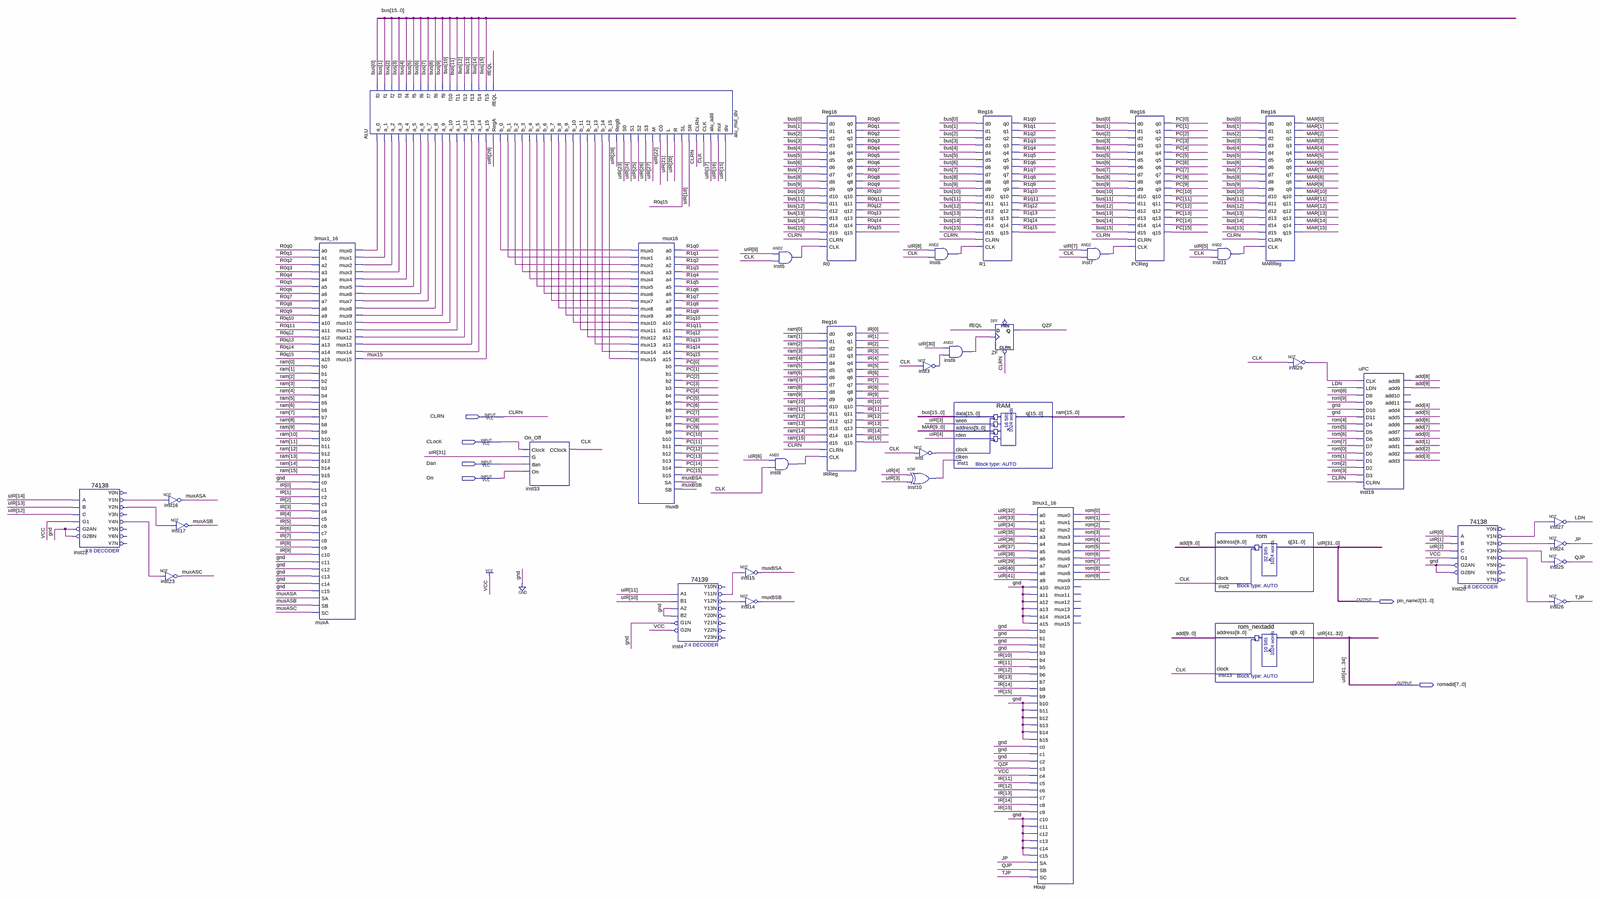
[diagram p0: schematic sheet, whole]
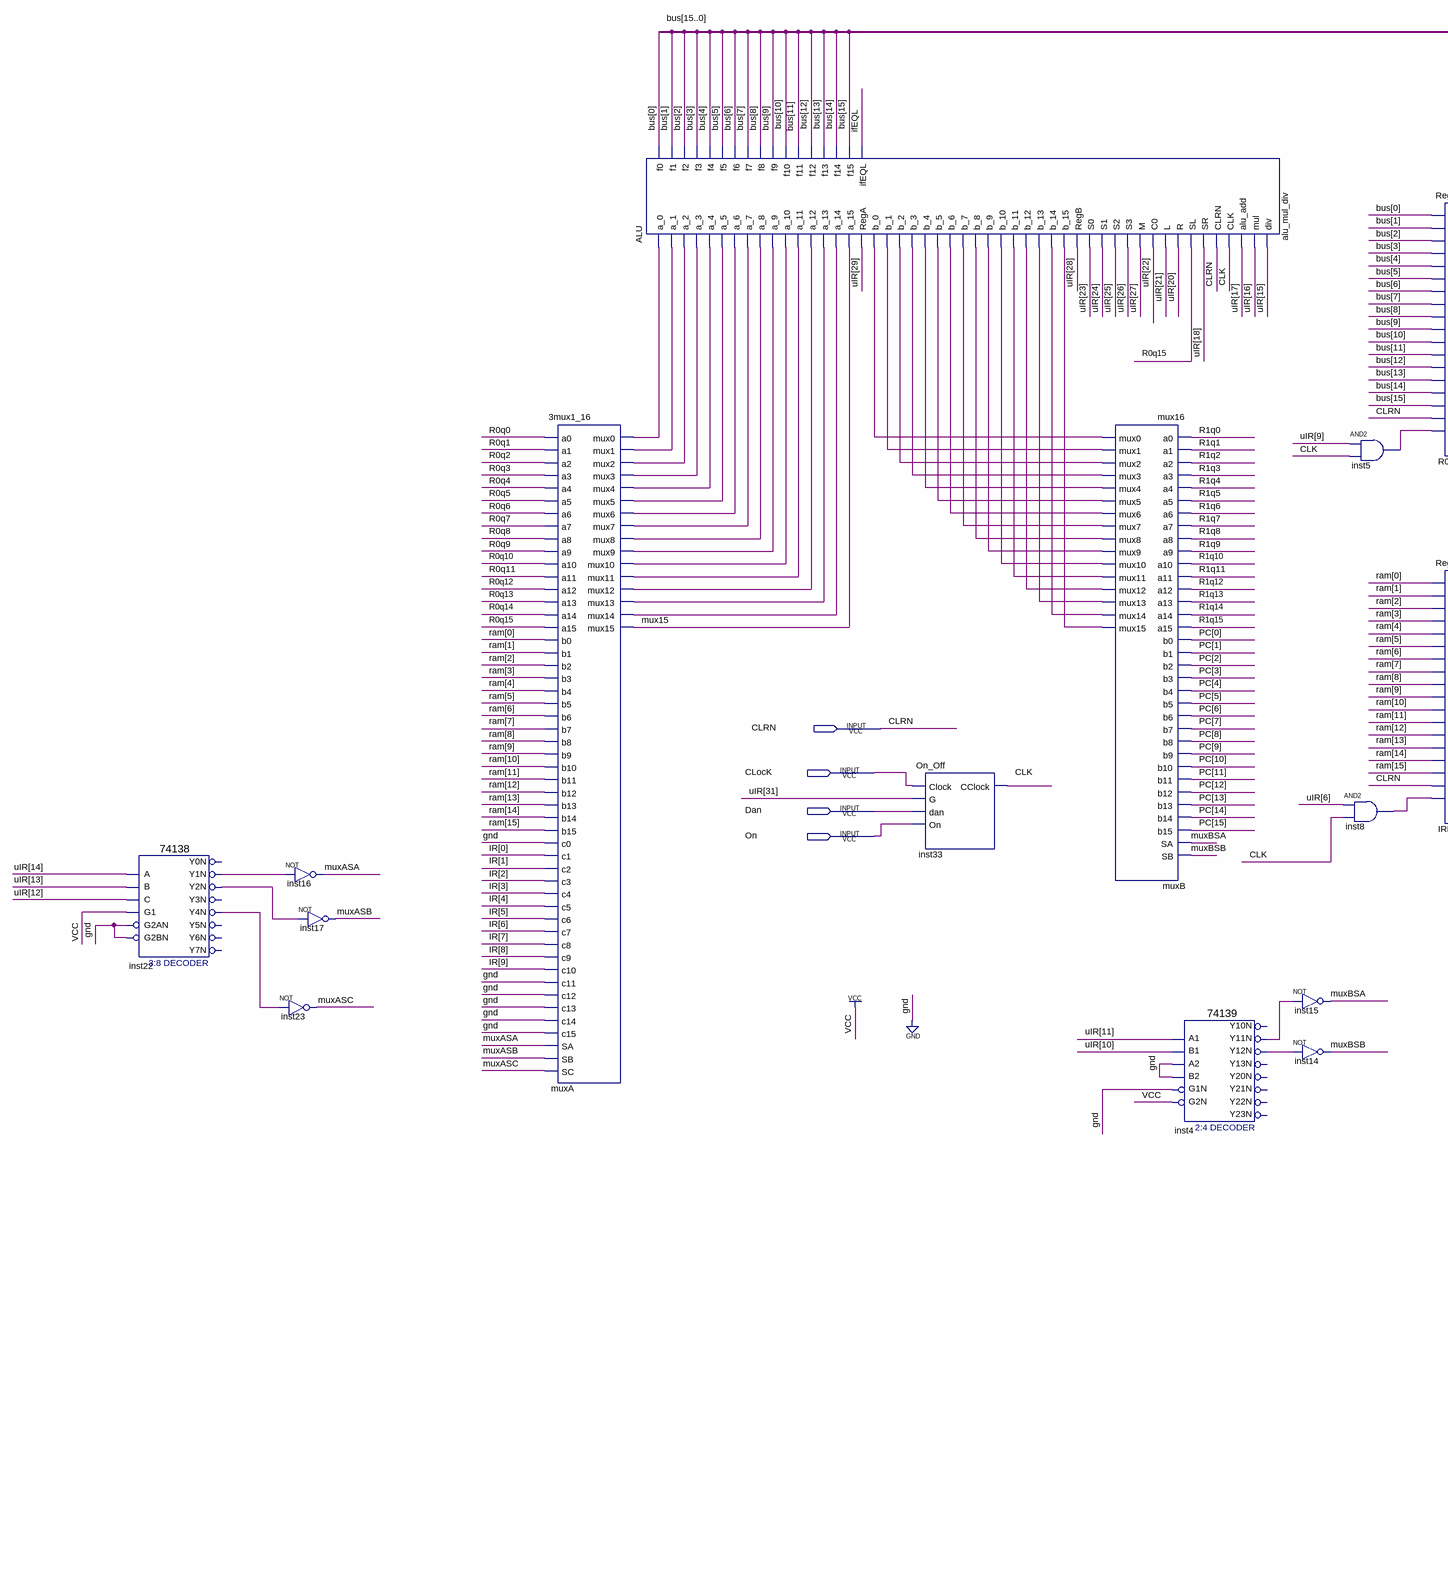
[diagram p1: schematic sheet, left part]
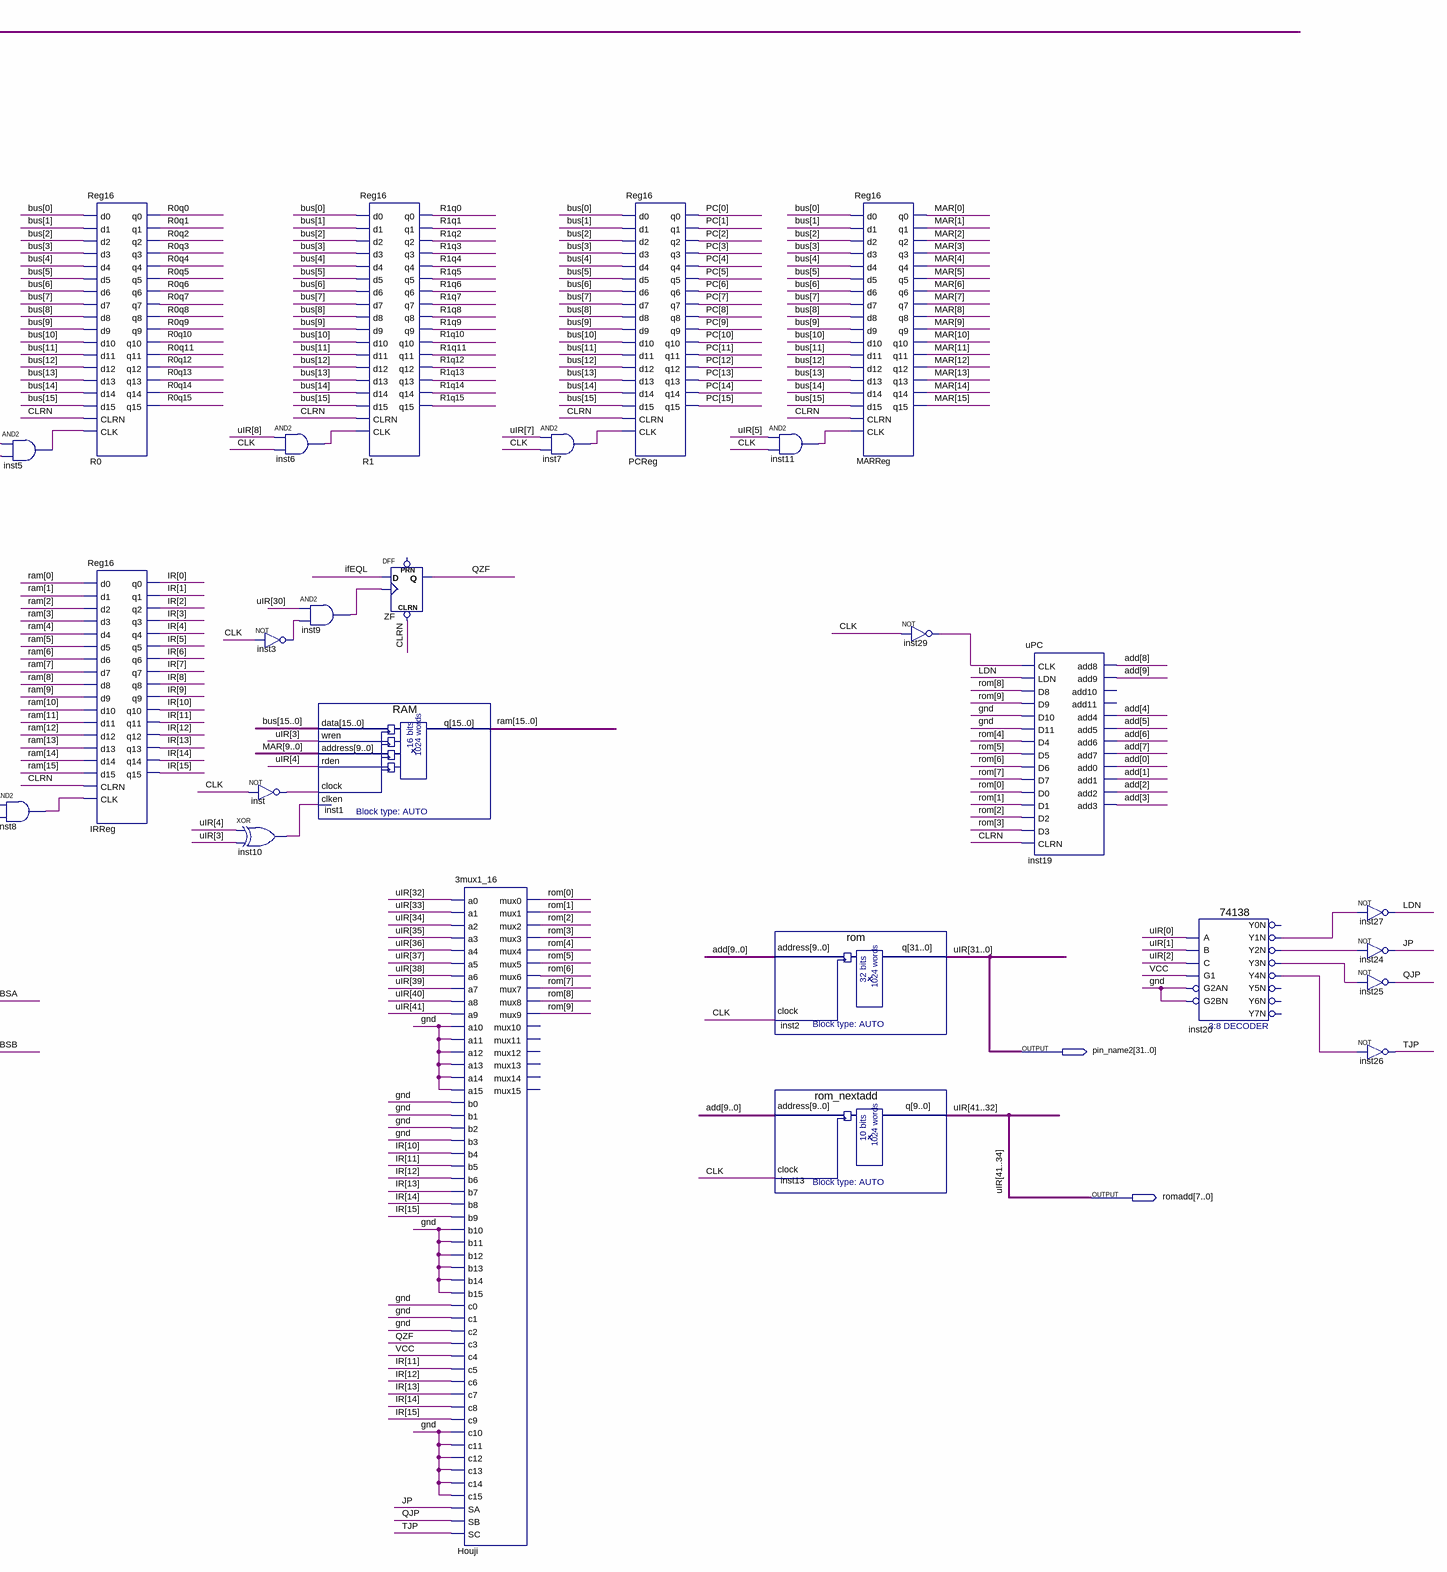
[diagram p2: schematic sheet, right part]
// Quartus schematic Micro_Programming.bdf as structural Verilog: 37 symbols, 6 pins
module Micro_Programming (
  input  CLRN,
  input  CLocK,
  input  Dan,
  input  On,
  output [31:0] pin_name2,
  output [7:0] romadd
);

  wire CLK, ifEQL, inst3_out, inst4_y11n, inst4_y12n, inst5_out, inst6_out, inst7_out, inst8_out, inst9_out,
       inst10_out, inst11_out, inst20_y1n, inst20_y2n, inst20_y3n, inst20_y4n, inst22_y1n, inst22_y2n,
       inst22_y4n, inst29_out, inst_out, JP, LDN, mux15, muxA_mux0, muxA_mux1, muxA_mux2, muxA_mux3,
       muxA_mux4, muxA_mux5, muxA_mux6, muxA_mux7, muxA_mux8, muxA_mux9, muxA_mux10, muxA_mux11, muxA_mux12,
       muxA_mux13, muxA_mux14, muxASA, muxASB, muxASC, muxB_mux0, muxB_mux1, muxB_mux2, muxB_mux3, muxB_mux4,
       muxB_mux5, muxB_mux6, muxB_mux7, muxB_mux8, muxB_mux9, muxB_mux10, muxB_mux11, muxB_mux12, muxB_mux13,
       muxB_mux14, muxB_mux15, muxBSA, muxBSB, QJP, QZF, R0q0, R0q1, R0q2, R0q3, R0q4, R0q5, R0q6, R0q7,
       R0q8, R0q9, R0q10, R0q11, R0q12, R0q13, R0q14, R0q15, R1q0, R1q1, R1q2, R1q3, R1q4, R1q5, R1q6, R1q7,
       R1q8, R1q9, R1q10, R1q11, R1q12, R1q13, R1q14, R1q15, TJP;
  wire [9:0] add, rom;
  wire [15:0] bus, IR, MAR, PC, ram;
  wire [33:32] uIR;

  \74138  inst22 (
    .A(pin_name2[14]), .B(pin_name2[13]), .G1(1'b1), .C(pin_name2[12]), .G2AN(1'b0), .G2BN(1'b0),
    .Y1N(inst22_y1n), .Y2N(inst22_y2n), .Y4N(inst22_y4n));  // open: Y0N, Y3N, Y5N, Y6N, Y7N
  not inst16 (muxASA, inst22_y1n);
  not inst17 (muxASB, inst22_y2n);
  not inst23 (muxASC, inst22_y4n);
  \3mux1_16  muxA (
    .a0(R0q0), .a1(R0q1), .a2(R0q2), .a3(R0q3), .a4(R0q4), .a5(R0q5), .a6(R0q6), .a7(R0q7), .a8(R0q8),
    .a9(R0q9), .a10(R0q10), .a11(R0q11), .a12(R0q12), .a13(R0q13), .a14(R0q14), .a15(R0q15), .b0(ram[0]),
    .b1(ram[1]), .b2(ram[2]), .b3(ram[3]), .b4(ram[4]), .b5(ram[5]), .b6(ram[6]), .b7(ram[7]), .b8(ram[8]),
    .b9(ram[9]), .b10(ram[10]), .b11(ram[11]), .b12(ram[12]), .b13(ram[13]), .b14(ram[14]), .b15(ram[15]),
    .c0(1'b0), .c1(IR[0]), .c2(IR[1]), .c3(IR[2]), .c4(IR[3]), .c5(IR[4]), .c6(IR[5]), .c7(IR[6]),
    .c8(IR[7]), .c9(IR[8]), .c10(IR[9]), .c11(1'b0), .c12(1'b0), .c13(1'b0), .c14(1'b0), .c15(1'b0),
    .SA(muxASA), .SB(muxASB), .SC(muxASC), .mux0(muxA_mux0), .mux1(muxA_mux1), .mux2(muxA_mux2),
    .mux3(muxA_mux3), .mux4(muxA_mux4), .mux5(muxA_mux5), .mux6(muxA_mux6), .mux7(muxA_mux7),
    .mux8(muxA_mux8), .mux9(muxA_mux9), .mux10(muxA_mux10), .mux11(muxA_mux11), .mux12(muxA_mux12),
    .mux13(muxA_mux13), .mux14(muxA_mux14), .mux15(mux15));
  ALU alu_mul_div (
    .a_0(muxA_mux0), .a_1(muxA_mux1), .a_2(muxA_mux2), .a_3(muxA_mux3), .a_4(muxA_mux4), .a_5(muxA_mux5),
    .a_6(muxA_mux6), .a_7(muxA_mux7), .a_8(muxA_mux8), .a_9(muxA_mux9), .a_10(muxA_mux10), .a_11(muxA_mux11),
    .a_12(muxA_mux12), .a_13(muxA_mux13), .a_14(muxA_mux14), .a_15(mux15), .RegA(pin_name2[29]),
    .b_0(muxB_mux0), .b_1(muxB_mux1), .b_2(muxB_mux2), .b_3(muxB_mux3), .b_4(muxB_mux4), .b_5(muxB_mux5),
    .b_6(muxB_mux6), .b_7(muxB_mux7), .b_8(muxB_mux8), .b_9(muxB_mux9), .b_10(muxB_mux10), .b_11(muxB_mux11),
    .b_12(muxB_mux12), .b_13(muxB_mux13), .b_14(muxB_mux14), .b_15(muxB_mux15), .RegB(pin_name2[28]),
    .S0(pin_name2[23]), .S1(pin_name2[24]), .S2(pin_name2[25]), .S3(pin_name2[26]), .M(pin_name2[27]),
    .C0(pin_name2[22]), .L(pin_name2[21]), .R(pin_name2[20]), .SL(R0q15), .SR(pin_name2[18]), .CLRN(CLRN),
    .CLK(CLK), .alu_add(pin_name2[17]), .mul(pin_name2[16]), .div(pin_name2[15]), .f0(bus[0]), .f1(bus[1]),
    .f2(bus[2]), .f3(bus[3]), .f4(bus[4]), .f5(bus[5]), .f6(bus[6]), .f7(bus[7]), .f8(bus[8]), .f9(bus[9]),
    .f10(bus[10]), .f11(bus[11]), .f12(bus[12]), .f13(bus[13]), .f14(bus[14]), .f15(bus[15]), .ifEQL(ifEQL));
  On_Off inst33 (.Clock(CLocK), .G(pin_name2[31]), .dan(Dan), .On(On), .CClock(CLK));
  mux16 muxB (
    .a0(R1q0), .a1(R1q1), .a2(R1q2), .a3(R1q3), .a4(R1q4), .a5(R1q5), .a6(R1q6), .a7(R1q7), .a8(R1q8),
    .a9(R1q9), .a10(R1q10), .a11(R1q11), .a12(R1q12), .a13(R1q13), .a14(R1q14), .a15(R1q15), .b0(PC[0]),
    .b1(PC[1]), .b2(PC[2]), .b3(PC[3]), .b4(PC[4]), .b5(PC[5]), .b6(PC[6]), .b7(PC[7]), .b8(PC[8]),
    .b9(PC[9]), .b10(PC[10]), .b11(PC[11]), .b12(PC[12]), .b13(PC[13]), .b14(PC[14]), .b15(PC[15]),
    .SA(muxBSA), .SB(muxBSB), .mux0(muxB_mux0), .mux1(muxB_mux1), .mux2(muxB_mux2), .mux3(muxB_mux3),
    .mux4(muxB_mux4), .mux5(muxB_mux5), .mux6(muxB_mux6), .mux7(muxB_mux7), .mux8(muxB_mux8),
    .mux9(muxB_mux9), .mux10(muxB_mux10), .mux11(muxB_mux11), .mux12(muxB_mux12), .mux13(muxB_mux13),
    .mux14(muxB_mux14), .mux15(muxB_mux15));
  \74139  inst4 (
    .A1(pin_name2[11]), .A2(1'b0), .B1(pin_name2[10]), .B2(1'b0), .G1N(1'b0), .G2N(1'b1), .Y12N(inst4_y12n),
    .Y11N(inst4_y11n));  // open: Y10N, Y20N, Y13N, Y21N, Y22N, Y23N
  not inst15 (muxBSA, inst4_y11n);
  not inst14 (muxBSB, inst4_y12n);
  and inst5 (inst5_out, pin_name2[9], CLK);
  and inst8 (inst8_out, pin_name2[6], CLK);
  Reg16 R0 (
    .d0(bus[0]), .d1(bus[1]), .d2(bus[2]), .d3(bus[3]), .d4(bus[4]), .d5(bus[5]), .d6(bus[6]), .d7(bus[7]),
    .d8(bus[8]), .d9(bus[9]), .d10(bus[10]), .d11(bus[11]), .d12(bus[12]), .d13(bus[13]), .d14(bus[14]),
    .d15(bus[15]), .CLRN(CLRN), .CLK(inst5_out), .q0(R0q0), .q1(R0q1), .q2(R0q2), .q3(R0q3), .q4(R0q4),
    .q5(R0q5), .q6(R0q6), .q7(R0q7), .q8(R0q8), .q9(R0q9), .q10(R0q10), .q11(R0q11), .q12(R0q12),
    .q13(R0q13), .q14(R0q14), .q15(R0q15));
  Reg16 IRReg (
    .d0(ram[0]), .d1(ram[1]), .d2(ram[2]), .d3(ram[3]), .d4(ram[4]), .d5(ram[5]), .d6(ram[6]), .d7(ram[7]),
    .d8(ram[8]), .d9(ram[9]), .d10(ram[10]), .d11(ram[11]), .d12(ram[12]), .d13(ram[13]), .d14(ram[14]),
    .d15(ram[15]), .CLRN(CLRN), .CLK(inst8_out), .q0(IR[0]), .q1(IR[1]), .q2(IR[2]), .q3(IR[3]), .q4(IR[4]),
    .q5(IR[5]), .q6(IR[6]), .q7(IR[7]), .q8(IR[8]), .q9(IR[9]), .q10(IR[10]), .q11(IR[11]), .q12(IR[12]),
    .q13(IR[13]), .q14(IR[14]), .q15(IR[15]));
  xor inst10 (inst10_out, pin_name2[4], pin_name2[3]);
  and inst6 (inst6_out, pin_name2[8], CLK);
  not inst3 (inst3_out, CLK);
  not inst (inst_out, CLK);
  and inst9 (inst9_out, pin_name2[30], inst3_out);
  RAM inst1 (
    .data(bus), .wren(pin_name2[3]), .address(MAR[9:0]), .rden(pin_name2[4]), .clock(inst_out),
    .clken(inst10_out), .q(ram));
  Reg16 R1 (
    .d0(bus[0]), .d1(bus[1]), .d2(bus[2]), .d3(bus[3]), .d4(bus[4]), .d5(bus[5]), .d6(bus[6]), .d7(bus[7]),
    .d8(bus[8]), .d9(bus[9]), .d10(bus[10]), .d11(bus[11]), .d12(bus[12]), .d13(bus[13]), .d14(bus[14]),
    .d15(bus[15]), .CLRN(CLRN), .CLK(inst6_out), .q0(R1q0), .q1(R1q1), .q2(R1q2), .q3(R1q3), .q4(R1q4),
    .q5(R1q5), .q6(R1q6), .q7(R1q7), .q8(R1q8), .q9(R1q9), .q10(R1q10), .q11(R1q11), .q12(R1q12),
    .q13(R1q13), .q14(R1q14), .q15(R1q15));
  DFF ZF (.CLRN(CLRN), .CLK(inst9_out), .D(ifEQL), .Q(QZF));  // open: PRN
  \3mux1_16  Houji (
    .a0(uIR[32]), .a1(uIR[33]), .a2(romadd[0]), .a3(romadd[1]), .a4(romadd[2]), .a5(romadd[3]),
    .a6(romadd[4]), .a7(romadd[5]), .a8(romadd[6]), .a9(romadd[7]), .a10(1'b0), .a11(1'b0), .a12(1'b0),
    .a13(1'b0), .a14(1'b0), .a15(1'b0), .b0(1'b0), .b1(1'b0), .b2(1'b0), .b3(1'b0), .b4(IR[10]), .b5(IR[11]),
    .b6(IR[12]), .b7(IR[13]), .b8(IR[14]), .b9(IR[15]), .b10(1'b0), .b11(1'b0), .b12(1'b0), .b13(1'b0),
    .b14(1'b0), .b15(1'b0), .c0(1'b0), .c1(1'b0), .c2(1'b0), .c3(QZF), .c4(1'b1), .c5(IR[11]), .c6(IR[12]),
    .c7(IR[13]), .c8(IR[14]), .c9(IR[15]), .c10(1'b0), .c11(1'b0), .c12(1'b0), .c13(1'b0), .c14(1'b0),
    .c15(1'b0), .SA(JP), .SB(QJP), .SC(TJP), .mux0(rom[0]), .mux1(rom[1]), .mux2(rom[2]), .mux3(rom[3]),
    .mux4(rom[4]), .mux5(rom[5]), .mux6(rom[6]), .mux7(rom[7]), .mux8(rom[8]), .mux9(rom[9]));  // open: mux10, mux11, mux12, mux13, mux14, mux15
  and inst7 (inst7_out, pin_name2[7], CLK);
  Reg16 PCReg (
    .d0(bus[0]), .d1(bus[1]), .d2(bus[2]), .d3(bus[3]), .d4(bus[4]), .d5(bus[5]), .d6(bus[6]), .d7(bus[7]),
    .d8(bus[8]), .d9(bus[9]), .d10(bus[10]), .d11(bus[11]), .d12(bus[12]), .d13(bus[13]), .d14(bus[14]),
    .d15(bus[15]), .CLRN(CLRN), .CLK(inst7_out), .q0(PC[0]), .q1(PC[1]), .q2(PC[2]), .q3(PC[3]), .q4(PC[4]),
    .q5(PC[5]), .q6(PC[6]), .q7(PC[7]), .q8(PC[8]), .q9(PC[9]), .q10(PC[10]), .q11(PC[11]), .q12(PC[12]),
    .q13(PC[13]), .q14(PC[14]), .q15(PC[15]));
  and inst11 (inst11_out, pin_name2[5], CLK);
  rom inst2 (.address(add), .clock(CLK), .q(pin_name2));
  rom_nextadd inst13 (.address(add), .clock(CLK), .q({romadd, uIR}));
  Reg16 MARReg (
    .d0(bus[0]), .d1(bus[1]), .d2(bus[2]), .d3(bus[3]), .d4(bus[4]), .d5(bus[5]), .d6(bus[6]), .d7(bus[7]),
    .d8(bus[8]), .d9(bus[9]), .d10(bus[10]), .d11(bus[11]), .d12(bus[12]), .d13(bus[13]), .d14(bus[14]),
    .d15(bus[15]), .CLRN(CLRN), .CLK(inst11_out), .q0(MAR[0]), .q1(MAR[1]), .q2(MAR[2]), .q3(MAR[3]),
    .q4(MAR[4]), .q5(MAR[5]), .q6(MAR[6]), .q7(MAR[7]), .q8(MAR[8]), .q9(MAR[9]), .q10(MAR[10]),
    .q11(MAR[11]), .q12(MAR[12]), .q13(MAR[13]), .q14(MAR[14]), .q15(MAR[15]));
  not inst29 (inst29_out, CLK);
  uPC inst19 (
    .CLK(inst29_out), .LDN(LDN), .D8(rom[8]), .D9(rom[9]), .D10(1'b0), .D11(1'b0), .D4(rom[4]), .D5(rom[5]),
    .D6(rom[6]), .D7(rom[7]), .D0(rom[0]), .D1(rom[1]), .D2(rom[2]), .D3(rom[3]), .CLRN(CLRN), .add8(add[8]),
    .add9(add[9]), .add4(add[4]), .add5(add[5]), .add6(add[6]), .add7(add[7]), .add0(add[0]), .add1(add[1]),
    .add2(add[2]), .add3(add[3]));  // open: add10, add11
  \74138  inst20 (
    .A(pin_name2[0]), .B(pin_name2[1]), .G1(1'b1), .C(pin_name2[2]), .G2AN(1'b0), .G2BN(1'b0),
    .Y1N(inst20_y1n), .Y2N(inst20_y2n), .Y3N(inst20_y3n), .Y4N(inst20_y4n));  // open: Y0N, Y5N, Y6N, Y7N
  not inst27 (LDN, inst20_y1n);
  not inst24 (JP, inst20_y2n);
  not inst25 (QJP, inst20_y3n);
  not inst26 (TJP, inst20_y4n);

  // Other names for the same wires on the sheet: uIR (some bits) = {romadd, pin_name2}
endmodule
